# Altium schematic sheet ПП4.SchDoc
size 209 x 297 mm; SheetNumber: 4; Обозначение: СФ МЭИ ПЭ2-18 11.03.04 03
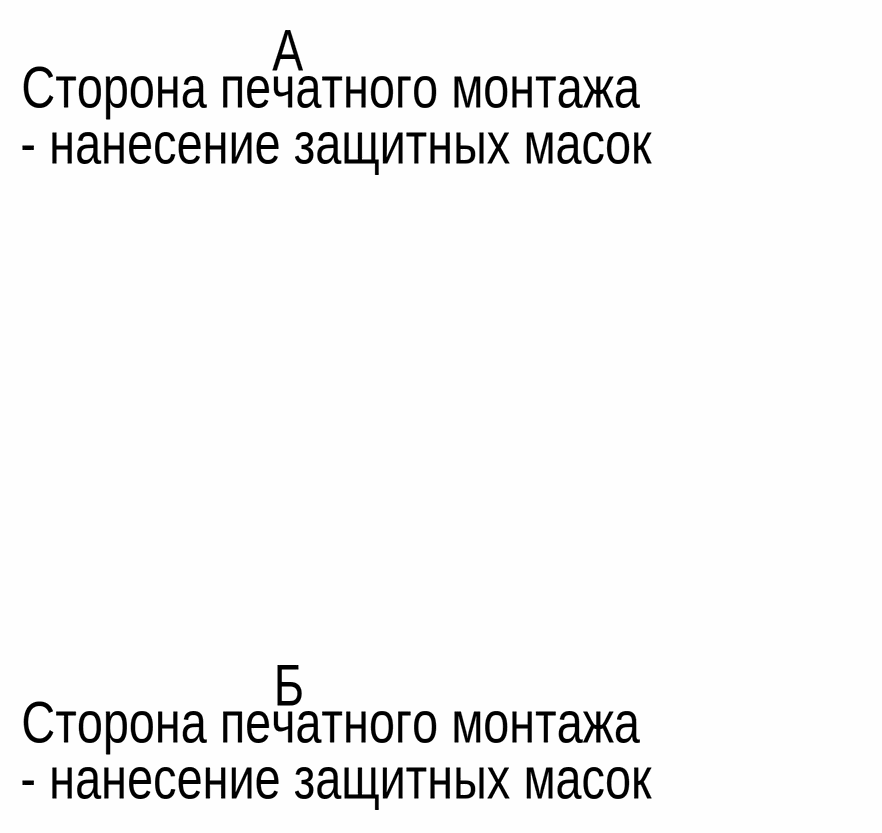
[diagram p0: ПП4.SchDoc]

## Notes on the sheet
- А
- Сторона печатного монтажа
- - нанесение защитных масок
- Б
- Подп. и дата
- Инв. № дубл.
- Взам. инв. №
- Инв. № подл.
- Изм.
- Лист
- № докум.
- Подп.
- Дата
- Копировал
- Формат А4